# EAGLE board Robo_opcao (EAGLE 9.5.1)
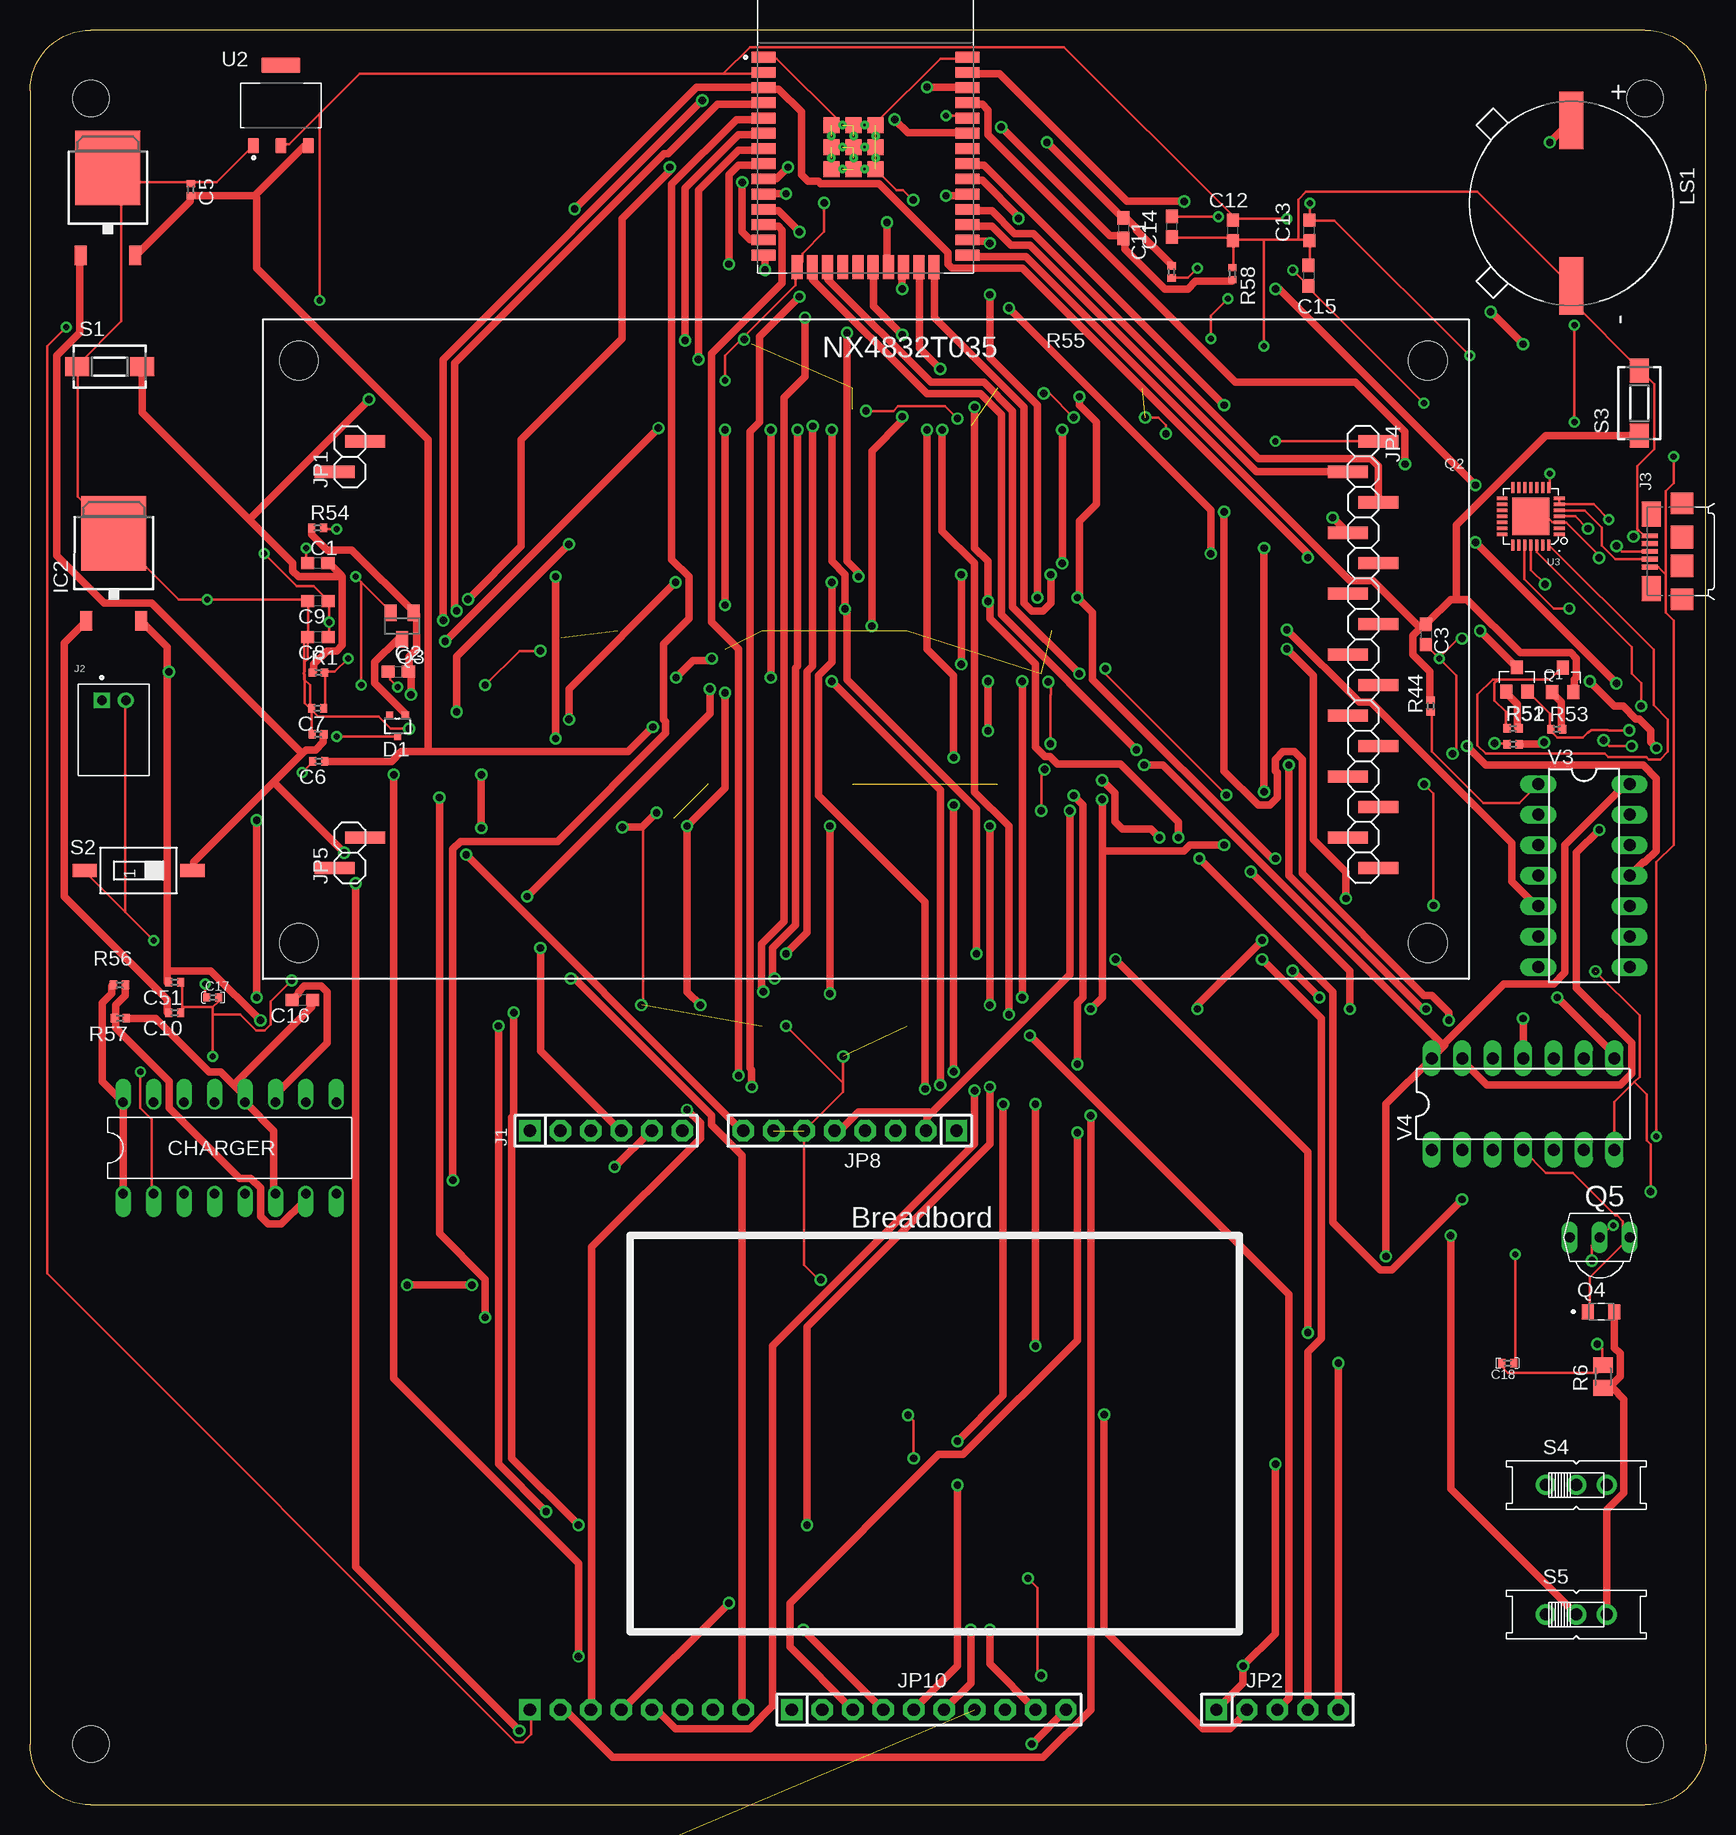
[diagram p2: board, top side]
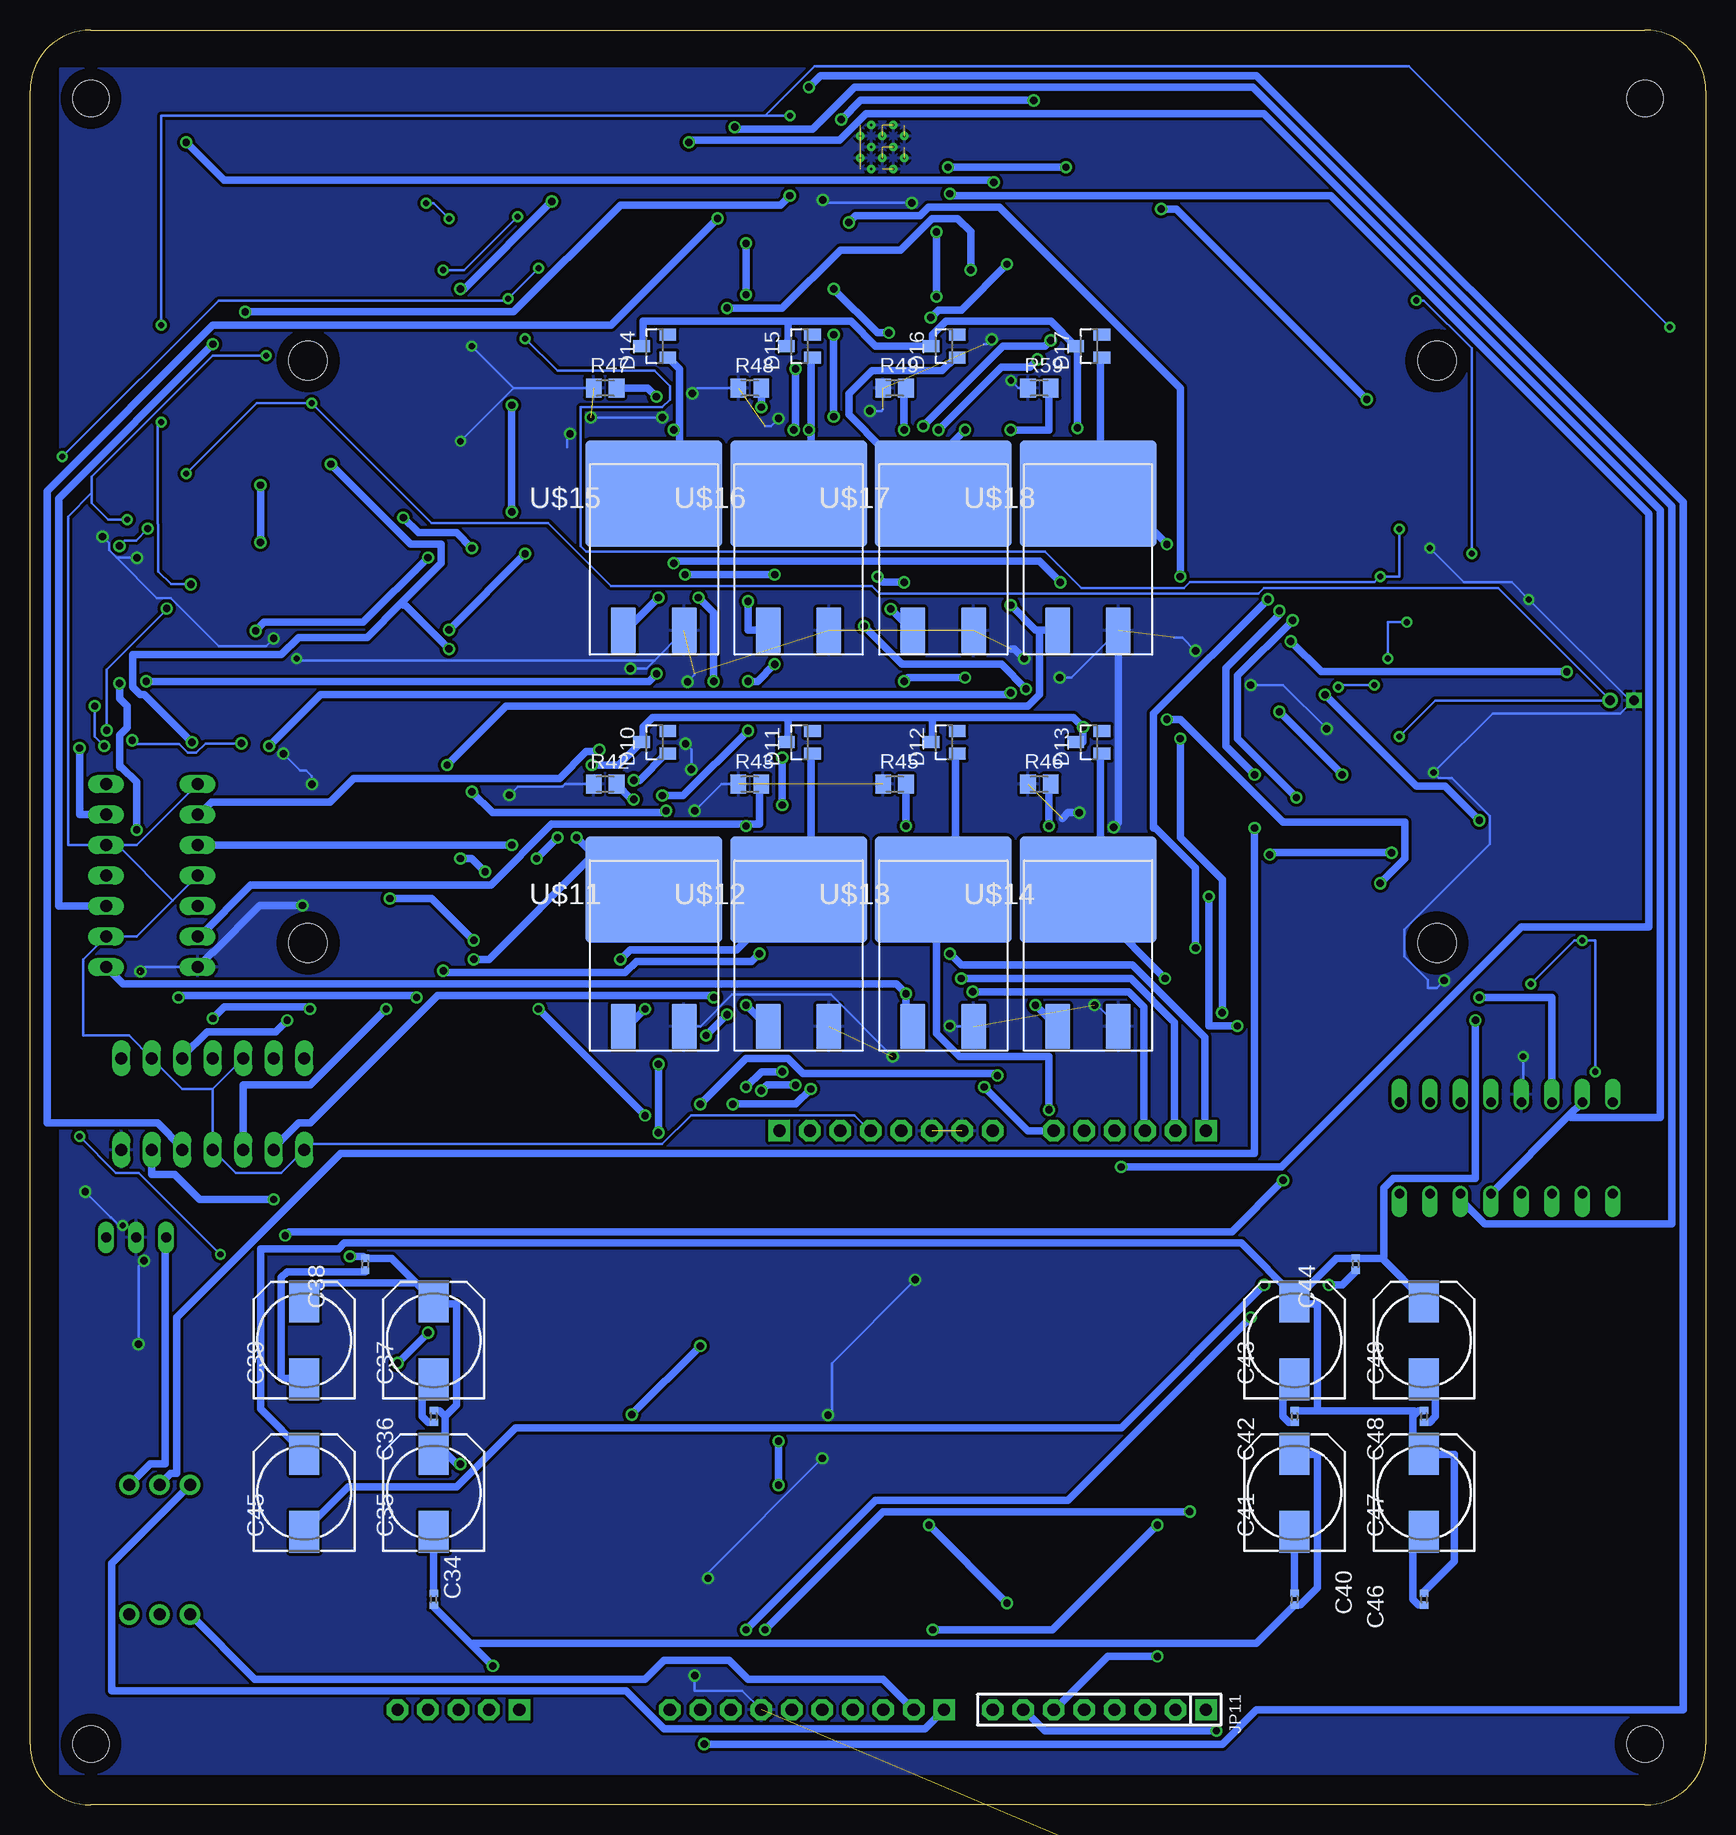
[diagram p3: board, bottom side, seen from below]

Size 139.7 x 147.96 mm. Coordinates in mm from the lower left corner, seen from the top.
Outline: 0,142.88 0,5.08 arc90 5.08,0 134.62,0 arc90 139.7,5.08 139.7,142.88 arc90 134.62,147.96 5.08,147.96 arc90 0,142.88
Copper layers (1*16): Top 0.035mm / dielectric 1.5mm / Bottom 0.035mm
Design rules "default *": minimum track width 8mil, minimum drill 6mil, track to track 6mil, track to pad 6mil, pad to pad 6mil, via to via 6mil, smd to smd 6mil, copper to edge 40mil, drill to drill 6mil, minimum pad ring 10mil, minimum via ring 8mil, stop-mask expansion 4mil, vias tented up to drill 0mil, thermal gap 10mil
Net classes: 0 default: width 0.61 mm, drill 0.61 mm, clearance 0.254 mm; 1 x: width 0.203 mm, drill 0.508 mm, clearance 0.254 mm
Holes 3 mm at 5.08,142.24 5.08,5.08 134.62,142.24 134.62,5.08

## Footprints (pad centres in the part's own frame; a part is rotated, then mirrored left to right if it is on the bottom)
C0603 = smd 1.1 x 1: 1 -0.85,0; 2 0.85,0
0402 = smd 0.6 x 0.7: 1 -0.5,0; 2 0.5,0
0402_POL = smd 0.6 x 0.7: P+ -0.5,0; P- 0.5,0
150CLZ-0810 = smd 3.5 x 2.5: + 3.25,0; - -3.25,0
DIP14 = drill 0.8 offset: P$1 -3.81,8.89; P$2 -3.81,6.35; P$3 -3.81,3.81; P$4 -3.81,1.27; P$5 -3.81,-1.27; P$6 -3.81,-3.81; P$7 -3.81,-6.35; P$8 -3.81,-8.89; P$9 3.81,-8.89; P$10 3.81,-6.35; P$11 3.81,-3.81; P$12 3.81,-1.27; P$13 3.81,1.27; P$14 3.81,3.81; P$15 3.81,6.35; P$16 3.81,8.89
SOT323 = smd 0.6 x 0.55: 1 -0.65,-0.925; 2 0.65,-0.925; 3 0,0.925
SOT23 = smd 1 x 1.4: 1 -0.95,-1.1; 2 0.95,-1.1; 3 0,1.1
TO252 = smd 1 x 1.6: 1 -2.28,-4.8; 2 2.28,-4.8 | smd 5.4 x 6.2: 3 0,2.5
SIP-100-06-40 = drill 1.016 pad 1.778 square: 1 -6.35,0 | drill 1.016 pad 1.778 octagon: 2 -3.81,0; 3 -1.27,0; 4 1.27,0; 5 3.81,0; 6 6.35,0
JST_S2B-PH-K-S(LF)(SN) = drill 0.8 square: 1 -1,0 | drill 0.8: 2 1,0
ZX62-B-5PA(11) = smd 0.4 x 1.35: 1 -1.3,2.675; 2 -0.65,2.675; 3 0,2.675; 4 0.65,2.675; 5 1.3,2.675 | smd 2.1 x 1.6: SH1 -3.1,2.55; SH2 3.1,2.55 | smd 1.8 x 1.9: SH3 -4,0; SH6 4,0 | smd 1.9 x 1.9: SH4 -1.2,0; SH5 1.2,0
1X02SMD = smd 1.016 x 3.302: 1 -1.27,1.27; 2 1.27,-1.27
SIP-100-05-40 = drill 1.016 pad 1.778 square: 1 -5.08,0 | drill 1.016 pad 1.778 octagon: 2 -2.54,0; 3 0,0; 4 2.54,0; 5 5.08,0
SIP-100-08-40 = drill 1.016 pad 1.778 square: 1 -8.89,0 | drill 1.016 pad 1.778 octagon: 2 -6.35,0; 3 -3.81,0; 4 -1.27,0; 5 1.27,0; 6 3.81,0; 7 6.35,0; 8 8.89,0
1X15SMD = smd 1.016 x 3.302: 1 -1.27,1.27; 2 1.27,-1.27; 3 3.81,1.27; 4 6.35,-1.27; 5 8.89,1.27; 6 11.43,-1.27; 7 13.97,1.27; 8 16.51,-1.27; 9 19.05,1.27; 10 21.59,-1.27; 11 24.13,1.27; 12 26.67,-1.27; 13 29.21,1.27; 14 31.75,-1.27; 15 34.29,1.27
SIP-100-10-40 = drill 1.016 pad 1.778 square: 1 -11.43,0 | drill 1.016 pad 1.778 octagon: 2 -8.89,0; 3 -6.35,0; 4 -3.81,0; 5 -1.27,0; 6 1.27,0; 7 3.81,0; 8 6.35,0; 9 8.89,0; 10 11.43,0
XDCR_CPT-1762_ROBO = smd 4.8 x 2: N 6.9,0; P -6.9,0
SOT-23 = smd 1.016 x 1.143: 1 -0.889,-1.016; 2 0.889,-1.016; 3 0,1.016
TRANS_SFH_3716 = smd 1 x 1.25: 1 -1.1,0; 2 1.1,0
TSOP18XX = drill 0.813 long: GND -0.001,-0.027; OUT -2.501,-0.027; VCC 2.499,-0.027
M0805 = smd 1.3 x 1.6: 1 -0.95,0; 2 0.95,0
DTSM-3 = smd 2 x 1.6: 1 -2.7,0; 2 2.7,0
SMS-001 = smd 1.092 x 2.007: 1 0,-4.496; 2 0,4.496
EG1218_ROBO = drill 1 pad 1.676: O -2.54,0; P 0,0; S 2.54,0
MODULE_ESP32-WROOM-32D = smd 2 x 0.9: 1 -8.5,5.26; 2 -8.5,3.99; 3 -8.5,2.72; 4 -8.5,1.45; 5 -8.5,0.18; 6 -8.5,-1.09; 7 -8.5,-2.36; 8 -8.5,-3.63; 9 -8.5,-4.9; 10 -8.5,-6.17; 11 -8.5,-7.44; 12 -8.5,-8.71; 13 -8.5,-9.98; 14 -8.5,-11.25; 25 8.5,-11.25; 26 8.5,-9.98; 27 8.5,-8.71; 28 8.5,-7.44; 29 8.5,-6.17; 30 8.5,-4.9; 31 8.5,-3.63; 32 8.5,-2.36; 33 8.5,-1.09; 34 8.5,0.18; 35 8.5,1.45; 36 8.5,2.72; 37 8.5,3.99; 38 8.5,5.26 | smd 0.9 x 2: 15 -5.715,-12.25; 16 -4.445,-12.25; 17 -3.175,-12.25; 18 -1.905,-12.25; 19 -0.635,-12.25; 20 0.635,-12.25; 21 1.905,-12.25; 22 3.175,-12.25; 23 4.445,-12.25; 24 5.715,-12.25 | smd 1.33 x 1.33: 39_1 -2.835,-0.405; 39_2 -1,-0.405; 39_3 0.835,-0.405; 39_4 -2.835,-2.24; 39_5 -1,-2.24; 39_6 0.835,-2.24; 39_7 -2.835,-4.075; 39_8 -1,-4.075; 39_9 0.835,-4.075 | drill 0.2 pad 0.3: 39_10 -1.917,-0.405; 39_11 -0.083,-0.405; 39_12 -2.835,-1.323; 39_13 -1,-1.323; 39_14 0.835,-1.323; 39_15 -1.917,-2.24; 39_16 -0.083,-2.24; 39_17 -2.835,-3.158; 39_18 -1,-3.158; 39_19 0.835,-3.158; 39_20 -1.917,-4.075; 39_21 -0.083,-4.075
SOT229P700X180-4N = smd 0.93 x 1.31: 1 -2.29,-3.345; 2 0,-3.345; 3 2.29,-3.345 | smd 3.24 x 1.31: 4 0,3.345
QFN28G_0.5-5X5MM_ROBO = smd 0.9 x 0.254: 1 -2.384,1.5; 2 -2.384,1; 3 -2.384,0.5; 4 -2.384,0; 5 -2.384,-0.5; 6 -2.384,-1; 7 -2.384,-1.5; 15 2.384,-1.5; 16 2.384,-1; 17 2.384,-0.5; 18 2.384,0; 19 2.384,0.5; 20 2.384,1; 21 2.384,1.5 | smd 0.254 x 0.9: 8 -1.5,-2.384; 9 -1,-2.384; 10 -0.5,-2.384; 11 0,-2.384; 12 0.5,-2.384; 13 1,-2.384; 14 1.5,-2.384; 22 1.5,2.384; 23 1,2.384; 24 0.5,2.384; 25 0,2.384; 26 -0.5,2.384; 27 -1,2.384; 28 -1.5,2.384 | smd 3.1 x 3.1: 29 0,0
NEXTION = hole 3.2: 4,50.54; 4,2; 98.1,2; 98.1,50.54
SMD = smd 2.08 x 3.81: 1 2.79,-13.85; 3 7.86,-13.85 | smd 11.43 x 8.89: 2 5.33,-2.45
DIL14_FT = drill 1 long: 1 -7.62,-3.81; 2 -5.08,-3.81; 3 -2.54,-3.81; 4 0,-3.81; 5 2.54,-3.81; 6 5.08,-3.81; 7 7.62,-3.81; 8 7.62,3.81; 9 5.08,3.81; 10 2.54,3.81; 11 0,3.81; 12 -2.54,3.81; 13 -5.08,3.81; 14 -7.62,3.81

## Placement (x,y rotation side)
C1  0,1 uF  [C0603]  23.99,103.52 0 top
C2  0,01 uF  [C0603]  30.7,94.46 0 top
C3  0,1 uF  [C0603]  116.36,97.57 270 top
C4  0.33uF  [0402]  24.02,89.24 0 top
C5  0.1uF  [0402]  13.4,134.65 270 top
C6  0.1uF  [0402]  24.07,86.99 180 top
C7  22uF  [0402]  23.97,91.41 180 top
C8  0,1 uF  [C0603]  24,97.34 180 top
C9  10 uF  [C0603]  24.01,100.36 180 top
C10  0.33uF  [0402]  12.06,66.04 180 top
C11  1 uF  [C0603]  91.13,131.44 270 top
C12  10 uF  [C0603]  100.29,131.24 90 top
C13  0,1 uF  [C0603]  106.64,131.24 90 top
C14  0,1 uF  [C0603]  95.21,131.56 90 top
C15  10 uF  [C0603]  106.58,127.48 270 top
C16  0.01 uF  [C0603]  22.7,67.09 180 top
C17  10uF  [0402_POL]  15.24,67.31 0 top
C18  20uF  [0402_POL]  123.19,36.83 180 top
C34  100n  [0402]  106.05,17.14 270 bottom
C35  470u  [150CLZ-0810]  106.05,26.04 90 bottom
C36  100n  [0402]  106.05,32.38 90 bottom
C37  470u  [150CLZ-0810]  106.05,38.73 90 bottom
C38  100n  [0402]  111.76,45.09 90 bottom
C39  470u  [150CLZ-0810]  116.84,38.73 90 bottom
C40  100n  [0402]  34.29,17.14 270 bottom
C41  470u  [150CLZ-0810]  34.29,26.04 90 bottom
C42  100n  [0402]  34.29,32.38 90 bottom
C43  470u  [150CLZ-0810]  34.29,38.73 90 bottom
C44  100n  [0402]  29.21,45.09 90 bottom
C45  470u  [150CLZ-0810]  116.84,26.04 90 bottom
C46  100n  [0402]  23.5,17.14 90 bottom
C47  470u  [150CLZ-0810]  23.5,26.04 90 bottom
C48  100n  [0402]  23.5,32.38 90 bottom
C49  470u  [150CLZ-0810]  23.5,38.73 90 bottom
C51  0.1uF  [0402]  12.06,68.58 180 top
CHARGER  MAX712  [DIP14]  16.65,54.78 90 top
D1  HSMS-285B  [SOT323]  30.64,89.95 180 top
D10  BAS40  [SOT23]  87.63,88.58 90 bottom
D11  BAS40  [SOT23]  75.56,88.58 90 bottom
D12  BAS40  [SOT23]  63.5,88.58 90 bottom
D13  BAS40  [SOT23]  51.44,88.58 90 bottom
D14  BAS40  [SOT23]  87.63,121.6 90 bottom
D15  BAS40  [SOT23]  75.56,121.6 90 bottom
D16  BAS40  [SOT23]  63.5,121.6 90 bottom
D17  BAS40  [SOT23]  51.44,121.6 90 bottom
IC1  7805DT  [TO252]  6.49,133.97 0 top
IC2  7805DT  [TO252]  6.99,103.5 0 top
J1  F-1X06-SIP-100-40  [SIP-100-06-40]  48.02,56.2 0 top
J2  S2B-PH-K-S(LF)(SN)  [JST_S2B-PH-K-S(LF)(SN)]  6.99,92.08 0 top
J3  ZX62-B-5PA  [ZX62-B-5PA(11)]  137.71,104.49 90 top
J4  F-1X06-SIP-100-40  [SIP-100-06-40]  9.84,-5.4 0 top  (outside the outline)
JP1  [1X02SMD]  26.67,112.39 90 top
JP2  F-1X05-SIP-100-40  [SIP-100-05-40]  103.98,7.94 0 top
JP3  F-1X08-SIP-100-40  [SIP-100-08-40]  12.38,-11.43 0 top  (outside the outline)
JP4  [1X15SMD]  111.12,112.39 270 top
JP5  [1X02SMD]  26.67,79.38 90 top
JP6  F-1X10-SIP-100-40  [SIP-100-10-40]  14.92,-17.46 0 top  (outside the outline)
JP7  F-1X05-SIP-100-40  [SIP-100-05-40]  8.57,-23.5 0 top  (outside the outline)
JP8  F-1X08-SIP-100-40  [SIP-100-08-40]  68.34,56.2 180 top
JP10  F-1X10-SIP-100-40  [SIP-100-10-40]  74.93,7.94 0 top
JP11  F-1X08-SIP-100-40  [SIP-100-08-40]  50.56,7.94 180 bottom
LS1  CPT-1762-90-SMT-TRXDCR_CPT-1762_ROBO  [XDCR_CPT-1762_ROBO]  128.48,133.52 270 top
Q1  SMD-TRANSISTORS-NPN-25V-500MW(SOT-23)  [SOT-23]  123.95,93.82 0 top
Q2  SMD-TRANSISTORS-NPN-25V-500MW(SOT-23)  [SOT-23]  127.76,93.79 0 top
Q3  [SOT23]  31.02,98.27 180 top
Q4  SFH_3716  [TRANS_SFH_3716]  130.97,41.12 0 top
Q5  TSOP4838  [TSOP18XX]  130.85,47.33 0 top
R1  10k  [0402]  24.04,94.39 0 top
R6  1k  [M0805]  131.13,35.72 90 top
R42  10k  [M0805]  91.76,85.09 0 bottom
R43  10k  [M0805]  79.69,85.09 0 bottom
R44  10k  [0402]  116.74,91.6 90 top
R45  10k  [M0805]  67.63,85.09 0 bottom
R46  10k  [M0805]  55.56,85.09 0 bottom
R47  10k  [M0805]  91.76,118.11 0 bottom
R48  10k  [M0805]  79.69,118.11 0 bottom
R49  10k  [M0805]  67.63,118.11 0 bottom
R51  470R  [0402]  123.62,88.42 0 top
R52  10k  [0402]  123.62,89.74 0 top
R53  10k  [0402]  127.27,89.68 0 top
R54  150R  [0402]  23.97,106.46 0 top
R55  680R  [0402]  95.15,127.79 270 top
R56  68k  [0402]  7.46,68.36 0 top
R57  22k  [0402]  7.52,65.56 180 top
R58  1R  [0402]  100.23,127.64 270 top
R59  10k  [M0805]  55.56,118.11 0 bottom
S1  EN  [DTSM-3]  6.64,119.89 0 top
S2  SWS001  [SMS-001]  9.05,77.89 270 top
S3  BOOT  [DTSM-3]  134.16,116.85 90 top
S4  EG1218  [EG1218_ROBO]  128.91,26.67 0 top
S5  EG1218  [EG1218_ROBO]  128.91,15.88 0 top
U1  ESP32-WROOM-32D  [MODULE_ESP32-WROOM-32D]  69.65,140.43 0 top
U2  AMS1117-3.3  [SOT229P700X180-4N]  20.93,141.67 0 top
U3  INTERFACE-CP2102-GMR(QFN28)QFN28G_ROBO  [QFN28G_0.5-5X5MM_ROBO]  125.09,107.41 180 top
U$1  [NEXTION]  18.42,69.85 0 top
U$11  IRFZ44NSMD  [SMD]  93.03,78.74 0 bottom
U$12  IRFZ44NSMD  [SMD]  80.96,78.74 0 bottom
U$13  IRFZ44NSMD  [SMD]  68.9,78.74 0 bottom
U$14  IRFZ44NSMD  [SMD]  56.83,78.74 0 bottom
U$15  IRFZ44NSMD  [SMD]  93.03,111.76 0 bottom
U$16  IRFZ44NSMD  [SMD]  80.96,111.76 0 bottom
U$17  IRFZ44NSMD  [SMD]  68.9,111.76 0 bottom
U$18  IRFZ44NSMD  [SMD]  56.83,111.76 0 bottom
V3  7408  [DIL14_FT]  129.54,77.47 270 top
V4  7408  [DIL14_FT]  124.46,58.42 0 top

## Tracks (layer width: path | path; a pad name or v marks a point on that pad's centre or on a via)
1_S  (via drill 0.61)
  Top 0.61: v54.61,122.08 54.61,134.78 59.05,139.22 61.12,139.22 U1.6 | v65.25,114.94 65.25,94.93 64.77,94.46 64.77,72.71 v63.02,70.96
  Bottom 0.61: v54.61,122.08 55.09,121.6 58.58,121.6 v65.25,114.94 | v63.02,70.96 62.07,70.01 47.78,70.01 41.75,63.98 41.75,56.2 J1.1
2_S  (via drill 0.61)
  Top 0.61: v55.72,120.49 55.72,134.62 59.05,137.95 61.12,137.95 U1.7 | v63.98,114.62 63.98,94.93 63.82,94.77 63.82,73.34 61.91,71.44 61.91,69.06 v62.07,68.9
  Bottom 0.61: v55.72,120.49 56.36,119.86 58.74,119.86 v63.98,114.62 | v62.07,68.9 47.94,68.9 44.29,65.25 44.29,56.2 J1.2
3_S  (via drill 0.61)
  Top 0.61: v58.26,128.43 58.26,135.89 59.05,136.68 61.12,136.68 U1.8 | v64.61,123.98 64.61,119.06 62.87,117.32 62.87,95.25 62.87,73.66 60.96,71.75 60.96,67.94 v61.12,67.79
  Bottom 0.61: v58.26,128.43 62.07,124.62 63.98,124.62 v64.61,123.98 | v61.12,67.79 48.1,67.79 46.83,66.52 46.83,56.2 J1.3
4_S  (via drill 0.61)
  Top 0.61: v63.18,136.53 62.23,135.57 61.28,135.57 U1.9 | v53.34,136.53 53.34,136.21 49.37,132.24 49.37,122.24 40.96,113.82 40.96,104.93 v36.51,100.49 | v42.55,71.44 42.55,62.87 49.21,56.2 J1.4
  Bottom 0.61: v53.34,136.53 v63.18,136.53 | v36.51,100.49 46.04,90.96 46.04,81.44 45.88,81.44 42.55,78.11 v42.55,71.44
5_S  (via drill 0.61)
  Top 0.61: v63.02,134.3 61.28,134.3 U1.10 | v48.74,53.18 51.75,56.2 J1.5
  Bottom 0.61: v63.02,134.3 62.87,134.14 31.27,134.14 4.76,107.63 4.76,73.18 15.4,73.18 35.4,53.18 v48.74,53.18
5V  (via drill 0.61)
  Top 0.61: v108.58,107.31 JP4.4 | v102.87,84.45 v102.87,104.78 | v86.68,82.87 86.68,69.22 75.09,57.63 | 75.09,57.63 74.77,57.31 74.77,56.2 JP8.2 | JP8.5 67.47,56.2 69.06,57.78 74.93,57.78 75.09,57.63
  Bottom 0.61: v108.58,107.31 107.31,106.05 104.14,106.05 v102.87,104.78 | v102.87,84.45 101.12,82.71 86.84,82.71 v86.68,82.87
6_S  (via drill 0.61)
  Top 0.61: v64.14,131.13 62.39,132.87 61.28,132.87 U1.11 | v64.14,125.73 60.8,122.4 60.8,115.25 60.01,114.46 60.01,61.44 60.17,61.28 v60.17,59.85
  Bottom 0.61: v64.14,125.73 v64.14,131.13 | v60.17,59.85 56.52,56.2 J1.6
7_S  (via drill 0.61)
  Top 0.61: v59.05,60.8 59.05,96.36 56.83,98.58 56.83,120.97 62.71,126.84 62.71,131.29 62.39,131.6 61.28,131.6 U1.12 | v83.82,38.26 v83.82,58.42 | v89.53,32.54 89.53,14.61 97.79,6.35 100.01,6.35 101.44,7.78 JP2.2
  Bottom 0.61: v59.05,60.8 59.21,60.96 75.25,60.96 76.52,62.23 80.01,62.23 v83.82,58.42 | v89.53,32.54 v83.82,38.26
8_S  (via drill 0.61)
  Top 0.61: v75.88,119.7 74.14,121.44 74.14,128.11 U1.23 | v76.04,114.62 76.04,106.2 78.74,103.5 78.74,84.45 81.6,81.6 v81.6,65.88 | v83.34,64.14 104.93,42.55 104.93,8.89 JP2.3
  Bottom 0.61: v75.88,119.7 75.88,114.62 v76.04,114.62 | v83.34,64.14 v81.6,65.88
9(5V)  (via drill 0.61)
  Top 0.61: v92.23,87.95 80.96,99.22 80.96,115.89 79.22,117.63 74.77,117.63 65.25,127.16 65.25,128.11 U1.16
  Bottom 0.61: v92.23,87.95 92.39,87.79 93.34,87.79 95.57,85.57 112.71,85.57 114.7,83.58 124.54,83.58 125.57,82.55 V3.2
10(5V)  (via drill 0.61)
  Top 0.61: v61.28,127.95 61.28,129.06 U1.14 | v81.6,124.78 98.42,107.95 v98.42,104.3 | v104.78,97.95 110.81,91.92 111.76,91.92 123.51,80.17 123.51,76.99 125.57,74.93 V3.5
  Bottom 0.61: v81.6,124.78 76.99,124.78 72.15,129.62 67.15,129.62 64.53,132.24 62.39,132.24 61.28,131.13 v61.28,127.95 | v104.78,97.95 v98.42,104.3
11(5V)  (via drill 0.61)
  Top 0.61: v76.36,134.14 78.11,134.14 U1.29 | v124.46,121.76 v121.76,124.46
  Bottom 0.61: v76.36,134.14 77.15,133.35 90.49,133.35 99.38,124.46 v121.76,124.46 | v124.46,121.76 137.32,108.9 137.32,74.93 V3.10
12(5V)  (via drill 0.61)
  Top 0.61: v87.47,94.3 81.92,99.85 81.92,116.2 79.53,118.59 75.09,118.59 66.52,127.16 66.52,128.11 U1.17 | v135.57,88.11 135.1,88.58 135.1,89.58 134.14,90.53 133.86,90.53 132.79,91.6 132.08,91.6 v130.02,93.66
  Bottom 0.61: v87.47,94.3 88.11,93.66 v130.02,93.66 | v135.57,88.11 135.57,82.55 V3.13
13(5V)  (via drill 0.61)
  Top 0.61: v80.01,130.18 79.85,130.33 78.26,130.33 U1.26 | v80.01,125.89 80.01,120.65 83.98,116.68 v83.98,100.65 | v82.71,67.31 v82.71,93.66
  Bottom 0.61: v80.01,125.89 v80.01,130.18 | v83.98,100.65 82.71,99.38 v82.71,93.66 | v82.71,67.31 82.87,67.47 105.73,67.47 116.36,56.83 117.32,56.83 119.38,54.77 V4.2
B+  (via drill 0.51)
  Top 0.203: v126.68,110.97 126.68,109.86 U3.8 | v116.2,116.84 106.52,126.52 C15.2 106.52,126.68 v105.25,127.95 | v99.06,132.4 95.25,132.4 C14.2 | v25.56,89.06 30.64,89.06 D1.3 | v14.61,68.42 14.61,67.31 C17.P+ | 7.94,74.45 4.6,77.79 S2.1 | 7.94,74.45 v10.32,72.07 | v9.21,61.12 9.21,58.1 10.16,57.15 10.16,51.12 CHARGER.P$2 | 7.94,74.45 7.94,92.08 J2.2
  Bottom 0.203: v126.68,110.97 120.81,116.84 v116.2,116.84 106.2,106.84 96.52,106.84 91.28,101.6 69.53,101.6 68.9,100.97 37.31,100.97 36.83,101.44 17.3,101.44 7.94,92.08 J2.2 22.54,92.08 v25.56,89.06 | v99.06,132.4 103.5,127.95 v105.25,127.95 | v14.61,68.42 10.95,72.07 v10.32,72.07 9.21,72.07 v9.21,61.12
B-  (via drill 0.61)
  Top 0.61: R58.2 100.17,127 97.16,127 96.52,126.36 94.61,126.36 91.28,129.7 91.28,130.49 C11.2 90.96,130.81 90.01,130.81 v80.96,139.86 | R57.1 10.48,65.56 14.92,61.12 15.88,61.12 16.99,60.01 | 16.99,60.01 17.78,59.21 17.78,58.74 CHARGER.P$12 18.1,58.42 20.32,56.2 20.32,51.12 CHARGER.P$6 | 16.99,60.01 23.5,66.52 23.5,66.99 C16.1
  Bottom 0.61: v80.96,139.86 80.8,139.7 74.45,139.7 70.96,143.19 37.78,143.19 2.86,108.27 2.86,48.42 18.41,48.42 20.32,50.32 20.32,50.96 CHARGER.P$6
BUZZER  (via drill 0.61)
  Top 0.61: v59.37,135.25 59.37,131.13 60.01,130.49 61.12,130.49 U1.13 | v126.68,138.59 128.43,140.34 LS1.P
  Bottom 0.61: v59.37,135.25 59.53,135.41 123.51,135.41 v126.68,138.59
DC_IN  (via drill 0.51)
  Top 0.203: v25.56,106.36 24.61,106.36 R54.2 | 27.62,101.92 30.16,99.38 Q3.2 | 27.62,101.92 v27.15,102.39 | v30.64,93.19 30,93.82 30,94.46 C2.1 | 27.62,101.92 v27.62,93.34 | v123.83,45.88 123.83,36.83 C18.P+ | v135.57,55.72 135.57,78.58 137,80.01 137,98.74 136.37,99.38 136.37,102.55 | 136.37,102.55 135.73,103.19 135.1,103.19 J3.1 | v97.31,128.11 96.52,127.32 95.25,127.32 R55.2 | v137,112.39 137,110.17 136.37,109.54 136.37,102.55 | v98.42,122.24 98.42,124.14 v99.85,125.57
  Bottom 0.203: v25.56,106.36 25.56,102.39 v27.15,102.39 27.62,101.92 43.02,101.92 43.5,101.44 52.07,101.44 55.09,104.46 93.34,104.46 93.82,104.93 93.82,116.52 87,116.52 86.36,117.16 86.36,118.27 87.63,119.54 95.73,119.54 v98.42,122.24 | v30.64,93.19 30.48,93.34 v27.62,93.34 | v123.83,45.88 130.65,52.7 132.56,52.7 v135.57,55.72 | v97.31,128.11 v99.85,125.57 100.01,125.41 123.98,125.41 v137,112.39
DTR
  Top 0.203: 122.4,93.82 122.08,93.5 122.08,92.08 123.03,91.12 123.03,89.85 R52.1 | 122.4,93.82 126.68,93.82 127.64,94.77 Q2.3 | U3.28 135.33,96.29 135.33,91.68 136.53,90.49 136.53,87.79 135.89,87.15 134.94,87.15 134.78,87.31 134.76,87.31 134.74,87.34 131.58,87.34 131.29,87.63 121.34,87.63 120.65,88.32 120.65,92.55 121.92,93.82 122.4,93.82
EN  (via drill 0.61)
  Top 0.61: 25.88,102.55 24.92,103.5 C1.2 | 25.88,102.55 26.04,102.39 26.04,96.68 25.56,96.2 24.77,96.2 23.65,95.09 23.65,94.46 R1.1 | 18.26,107.16 21.91,103.5 21.91,102.87 22.38,102.39 25.72,102.39 25.88,102.55 | 18.26,107.16 9.37,116.05 9.37,119.86 S1.2 | v120.89,97.87 123.83,94.93 Q1.3 | v106.52,103.98 106.52,104.3 82.71,128.11 76.83,128.11 76.52,128.43 76.52,129.38 70.77,135.13 65.92,135.13 65.71,135.33 64.85,135.33 64.29,135.89 64.29,141.13 62.39,143.03 61.28,143.03 U1.3 60.96,143.19 55.56,143.19 v45.4,133.03 | v28.26,117.16 18.26,107.16
  Bottom 0.61: v120.89,97.87 120.17,98.58 111.92,98.58 v106.52,103.98 | v28.26,117.16 44.13,133.03 v45.4,133.03
GND  (via drill 0.51, 0.61)  (27 unrouted)
  Top 0.203: U2.1 18.57,138.27 15.56,135.25 13.49,135.25 C5.1 13.34,135.25 7.62,135.25 | 7.62,135.25 6.51,136.37 IC1.3 7.62,135.25 | C4.1 23.5,89.38 23.5,91.28 C7.2 23.34,91.44 23.34,93.34 22.86,93.82 22.86,97.16 23.02,97.31 C8.2 | C8.2 23.18,97.47 23.18,100.33 C9.2 23.02,100.49 v14.76,100.49 12.38,100.49 6.99,105.89 IC2.3 6.99,106.05 3.97,109.06 3.97,119.86 S1.1 3.97,120.02 7.62,123.67 7.62,135.25 | C15.1 106.68,128.43 106.68,130.33 C13.1 106.52,130.49 105.73,130.49 | R58.1 100.33,128.27 100.33,130.33 C12.1 | C14.1 95.25,130.65 100.01,130.65 100.17,130.49 C12.1 | 102.87,130.49 100.33,130.49 C12.1 | 102.87,130.49 105.73,130.49 | J3.5 134.94,105.89 134.46,105.89 134.06,106.28 | 105.73,130.49 105.73,133.83 106.36,134.46 120.65,134.46 128.43,126.68 LS1.N 128.59,126.52 128.59,125.25 134.14,119.7 S3.2 134.3,119.54 135.41,118.43 135.41,113.03 133.99,111.6 133.99,106.36 134.06,106.28 | 131.05,36.43 131.13,36.51 R6.2 | 131.05,36.43 130.65,36.04 123.19,36.04 122.71,36.51 122.71,36.83 C18.P- | 12.7,66.52 12.7,68.58 C51.1 | 12.7,66.52 12.7,66.04 C10.1 | 15.24,66.52 15.72,66.99 15.72,67.31 C17.P- | 12.7,66.52 15.24,66.52 | v22.7,86.04 23.5,86.84 C6.2 | v23.02,104.78 23.02,103.66 C1.1 | v117.47,95.57 116.36,96.68 C3.2 | U1.39_7 66.83,136.37 66.83,137.16 U1.39_17 | U1.39_8 68.74,136.37 68.74,137.16 U1.39_18 | U1.39_4 66.83,138.27 66.83,139.06 U1.39_12 | U1.39_21 69.69,136.37 70.33,136.37 U1.39_9 72.22,134.62 72.79,134.62 v73.62,133.79 | U1.39_1 66.83,140.02 67.63,140.02 U1.39_10 67.63,140.18 62.23,145.57 61.28,145.57 U1.1 | U1.39_5 68.74,138.27 68.74,139.06 U1.39_13 | U1.39_6 70.33,138.27 69.69,138.27 U1.39_16
  Top 0.203: U1.39_2 68.74,140.02 69.53,140.02 U1.39_11 69.69,140.02 70.33,140.02 U1.39_3 70.48,140.18 75.88,145.57 78.11,145.57 U1.38 | 59.45,122.32 57.94,120.81 v57.94,118.75 | 59.45,122.32 63.82,126.68 63.82,128.11 U1.15 64.4,128.65 64.4,129.33 66.2,131.13 v66.2,133.54 | v15.24,62.39 15.24,65.88 | 15.24,65.88 15.24,66.52 | v103.82,113.67 JP4.1 | v102.87,121.6 102.87,130.49 | U3.29 126.4,107.41 126.88,106.93 127.46,106.93 U3.3 127.5,106.9 128.08,106.9 130.79,104.18 v130.79,103.96 | v65.92,43.78 65.76,43.78 64.53,45.01 JP8.6 67.79,59.45 67.79,60.17 | v73.18,32.5 73.66,32.02 v73.66,28.89 | v84.3,10.79 83.98,11.11 83.98,18.1 v83.19,18.89 | v92.96,115.66 94.05,115.66 94.69,115.02 v94.69,114.3 | v84.5,117.67 84.98,117.67 v86.99,115.66 | v117.47,95.57 118.9,94.14 118.9,87.95 v118.59,87.63 | v116.2,85.09 117,84.3 v117,74.97 | v99.73,84.18 89.65,94.26 v89.65,94.73 | v84.3,82.87 84.3,86.04 v84.57,86.32 | v85.06,88.45 85.06,92.52 85.09,92.55 85.09,93.42 v84.89,93.62 | v67.79,62.39 67.79,60.17 | v63.02,64.93 67.79,60.17 | V4.7 132.08,58.6 133.74,60.26 | 133.74,60.26 134.17,60.69 134.17,65.81 v130.49,69.49 | v21.82,68.73 20.07,66.98 20.07,65.05 19.57,64.54 18.85,64.54 17.51,65.88 15.24,65.88 | v69.69,116.2 71.96,116.2 72.35,116.59 76.29,116.59 v77.31,115.57 | 59.45,122.32 59.45,122.24 v59.53,122.16 | C8.2 23.15,95.52 22.88,95.25 22.88,94.5 22.83,94.31 22.88,94.22 22.88,91.84 24.02,90.71 29.08,90.71 30.08,89.71 v31.61,89.71 | v37.94,93.34 40.8,96.2 v42.55,96.2 | 51.12,81.6 51.12,66.83 v50.96,66.67 | 133.74,60.26 134.76,59.23 134.76,55.38 135.1,55.05 v135.1,51.12 | 134.06,106.28 133.67,105.88 v133.67,105.73
  Top 0.203: v117.47,95.57 117.47,95.65 119.14,97.31 119.3,97.31 v119.38,97.23 | v131.98,48.32 131.87,48.32 Q5.GND 130.2,46.66 v130.2,45.38 | v130.65,38.42 131.05,38.02 131.05,36.43
  Top 0.61: v49.37,81.5 51.02,81.5 51.12,81.6 v52.23,82.71 | v53.86,93.98 55.29,95.41 56.67,95.41 v56.83,95.57
  Bottom 0.203: 6.19,91.92 6.03,92.08 J2.1 6.19,91.92 | 6.19,91.92 7.14,90.96 17.78,90.96 v22.7,86.04 22.25,85.59 21.19,85.59 18.03,82.43 18.03,80.09 25.14,72.98 25.14,70.72 23.18,68.76 23.18,68.1 22.44,68.1 v21.82,68.73 | v23.02,104.78 20.16,101.92 16.19,101.92 v14.76,100.49 6.19,91.92 | v117.47,95.57 117.32,95.41 87.63,95.41 | 87.63,95.41 85.25,97.79 U$15.3 | v57.94,118.75 57.31,118.11 R59.1 | v15.24,62.39 15.24,58.74 CHARGER.P$13 | 99.38,118.11 v103.82,113.67 | R47.1 99.38,118.11 | 99.38,118.11 v102.87,121.6 | v65.92,43.78 72.87,36.83 72.87,32.82 v73.18,32.5 | v73.66,28.89 83.19,19.37 v83.19,18.89 | JP10.7 80.33,9.53 84.3,9.53 v84.3,10.79 | R48.1 84.06,118.11 v84.5,117.67 | v94.69,114.3 94.93,114.05 94.93,113.19 | v86.99,115.66 v92.96,115.66 | R43.1 82.07,85.09 v84.3,82.87 | v118.59,87.63 117.18,86.23 116.68,86.23 116.2,85.75 v116.2,85.09 | R42.1 95.11,85.09 95.29,84.91 99.01,84.91 v99.73,84.18 | v89.65,94.73 88.31,94.73 87.63,95.41 | v84.57,86.32 84.57,87.97 v85.06,88.45 | v84.89,93.62 84.3,94.21 84.3,94.3 | U$11.3 83.81,64.89 81.16,67.54 72.94,67.54 v67.79,62.39 | U$13.3 62.98,64.89 v63.02,64.93 | V3.7 130.13,69.85 v130.49,69.49 | 130.49,69.37 130.57,69.45 | v77.31,115.57 77.95,114.94 78.42,114.94 | v69.69,116.2 68.74,116.2 68.58,116.36 | v59.53,122.16 59.93,121.76 60.17,121.76 | v31.61,89.71 35.24,93.34 v37.94,93.34 | v42.55,96.2 43.66,97.31 44.29,97.31 | U$18.3 52.9,93.98 v53.86,93.98 | U$14.3 50.76,66.67 v50.96,66.67 | v73.62,133.79 73.38,133.54 v66.2,133.54 | v133.67,105.73 133.11,105.18 133.11,104.59 132.49,103.96 | v130.79,103.96 132.49,103.96 | 132.49,103.96 129.12,100.6 127.95,100.6 123.95,96.6 120.02,96.6 v119.38,97.23
  Bottom 0.203: v135.1,51.12 132.96,48.98 132.93,48.98 132.27,48.32 v131.98,48.32 | v130.2,45.38 130.65,44.93 v130.65,38.42
  Bottom 0.61: V3.7 124.5,71.08 124.43,71.08 120.53,74.97 v117,74.97 | U$18.3 48.97,81.9 v49.37,81.5 | v52.23,82.71 53.18,82.71 53.66,82.23 | v56.83,95.57 57.63,96.36 57.94,96.36
  pour Bottom: 2.54,2.54 137.16,2.54 137.16,144.78 2.54,144.78
GND_PWM~5V  (via drill 0.61)
  Top 0.61: IC1.2 8.89,129.22 13.34,133.67 13.34,134.14 C5.2 13.65,134.14 18.73,134.14 | 18.73,134.14 22.86,138.27 23.18,138.27 U2.3 | 33.18,87.79 49.85,87.79 v51.91,89.85 | 33.18,87.79 30.96,87.79 30.16,87 24.61,87 C6.1 | 33.18,87.79 33.18,113.82 18.89,128.11 18.89,133.99 18.73,134.14 | 117.87,63.26 117.95,63.34 117.95,63.5 122.87,68.42 127,68.42 127.95,69.37 127.95,80.01 133.03,85.09 V3.14 | 117.87,63.26 V4.14 113.03,58.42 v113.03,45.72 | JP2.1 101.12,10.16 v101.12,11.59 103.82,14.29 v103.82,28.42 | v92.87,86.68 94.46,86.68 117.87,63.26
  Bottom 0.61: D13.3 51.91,88.58 v51.91,89.85 52.7,90.65 64.45,90.65 | 64.45,90.65 64.45,88.58 D12.3 | 76.52,90.65 76.52,88.58 D11.3 | 64.45,90.65 76.52,90.65 | 105.09,32.38 105.57,32.86 106.05,32.86 C36.2 | 105.09,32.38 105.09,29.37 106.05,29.37 C35.+ 104.93,29.21 104.14,28.42 v103.82,28.42 | 107.63,43.66 106.05,42.07 C37.+ 105.89,41.75 104.14,41.75 104.14,33.34 105.09,32.38 | 107.63,43.66 109.54,45.56 111.76,45.56 C38.2 111.92,45.72 v113.03,45.72 | C39.+ 116.84,42.07 115.41,43.5 107.79,43.5 107.63,43.66 | C41.+ 34.29,29.21 32.38,29.21 32.38,18.1 33.81,16.67 34.29,16.67 C40.2 34.45,16.51 37.47,13.49 102.71,13.49 102.87,13.34 | v101.12,11.59 102.87,13.34 | 102.87,13.34 106.05,16.51 C34.2 | v92.87,86.68 90.65,86.68 88.9,88.42 D10.3 88.58,88.58 88.58,89.85 87.79,90.65 76.52,90.65
GND_PWM~5V1(2)  (via drill 0.61)
  Top 0.61: 11.43,94.46 11.43,96.52 9.37,98.58 IC2.2 | 11.43,94.46 11.43,69.53 | 11.43,69.53 11.43,68.58 C51.2 | 11.43,69.53 15.08,69.53 v19.21,65.41 | v34.61,97 v52.39,114.78 | v11.59,94.46 11.43,94.46
  Bottom 0.61: 76.52,123.67 76.52,121.6 D15.3 | 76.52,123.67 71.28,123.67 69.22,121.6 D16.3 64.45,121.6 64.45,122.56 63.34,123.67 54.61,123.67 D17.3 52.39,121.44 v52.39,114.78 | 76.52,123.67 88.58,123.67 88.58,121.6 D14.3 | C46.2 23.5,17.78 20.95,20.32 20.95,29.21 23.5,29.21 C47.+ 23.65,29.53 24.45,29.53 24.45,32.38 24.13,32.7 | 24.13,32.7 23.97,32.86 23.5,32.86 C48.2 | 32.38,32.86 24.29,32.86 24.13,32.7 | 32.38,32.86 34.29,32.86 C42.2 | C43.+ 34.29,42.07 30.8,45.56 29.21,45.56 C44.2 29.05,45.56 26.99,45.56 | C45.+ 116.84,29.37 120.49,33.02 120.49,46.35 113.98,46.35 113.51,46.83 38.73,46.83 34.29,42.39 C43.+ | 26.99,45.56 23.5,42.07 C49.+ | 32.38,32.86 32.38,41.75 34.13,41.75 C43.+ | v19.21,65.41 19.21,52.23 26.04,52.23 26.83,51.44 26.83,45.72 26.99,45.56 | v34.61,97 32.07,94.46 v11.59,94.46
I2C_SCL  (via drill 0.61)
  Top 0.61: v74.77,143.19 78.11,143.19 U1.36 | JP10.10 v83.5,5.08
  Bottom 0.61: v74.77,143.19 73.82,144.15 37.47,144.15 1.91,108.58 1.91,7.94 37.47,7.94 40.32,5.08 v83.5,5.08
I2C_SDA  (via drill 0.61)
  Top 0.61: v72.07,140.49 73.18,139.38 78.11,139.38 U1.33 | v56.04,142.08 34.45,120.49 v34.45,98.74 | v34.13,83.98 34.13,47.62 37.94,43.81 v37.94,40.64 | v80.01,14.61 80.01,11.75 JP10.9
  Bottom 0.61: v72.07,140.49 70.48,142.08 v56.04,142.08 | v37.94,40.64 53.18,25.4 69.22,25.4 v80.01,14.61 | v34.45,98.74 39.05,94.14 39.05,88.9 v34.13,83.98
IO0
  Top 0.61: 115.89,98.11 116.05,98.27 116.36,98.27 C3.1 116.52,98.58 118.43,100.49 118.9,100.49 | 115.89,98.11 115.25,97.47 115.25,95.89 116.68,94.46 116.68,92.23 R44.2 | Q2.2 128.75,92.87 128.75,93.82 128.91,93.98 128.91,95.57 128.43,96.04 124.22,96.04 119.78,100.49 118.9,100.49 | 115.89,98.11 111.92,102.08 110.01,102.08 83.03,129.06 78.26,129.06 U1.25 | 118.9,100.49 118.9,106.68 126.36,114.14 134.14,114.14 S3.1
MISO  (via drill 0.61)
  Top 0.61: v72.71,126.36 72.71,128.11 U1.22 | v68.1,122.71 68.1,103.66 69.06,102.71 v69.06,102.39 | v66.83,101.92 66.83,95.25 65.72,94.14 65.72,84.14 74.61,75.25 v74.61,59.69 | v81.12,58.42 81.12,34.13 v77.31,30.32 | v77.31,26.67 77.31,11.59 JP10.5
  Bottom 0.61: v72.71,126.36 69.06,122.71 v68.1,122.71 | v69.06,102.39 68.58,101.92 v66.83,101.92 | v74.61,59.69 75.88,58.42 v81.12,58.42 | v77.31,26.67 v77.31,30.32
MOSI  (via drill 0.61)
  Top 0.61: v71.44,131.92 71.44,128.27 U1.21 | v43.81,88.9 v43.81,102.39 | v40.32,66.04 40.32,57.47 40.16,57.31 40.16,28.89 v45.72,23.34 | JP10.4 v64.45,14.61
  Bottom 0.61: v71.44,131.92 70.88,132.48 65.52,132.48 64.8,133.19 58.9,133.19 43.81,118.11 v43.81,102.39 | v43.81,88.9 43.81,80.64 40.32,77.15 v40.32,66.04 | v45.72,23.34 54.45,14.61 v64.45,14.61
N$3  (via drill 0.61)
  Top 0.203: U3.26 125.61,105.01 125.61,104.43 133.51,96.53 133.51,94.3 134.3,93.5 v134.3,91.6 | R51.1 123.05,88.49 v122.08,88.49 | v133.51,88.27 131.65,88.27 v131.17,88.74
  Bottom 0.203: v122.08,88.49 125.07,88.49 125.85,87.72 126.56,87.72 127.27,88.42 130.85,88.42 v131.17,88.74 | v133.51,88.27 134.3,89.06 v134.3,91.6
N$12
  Bottom 0.61: C35.- C34.1
N$13
  Bottom 0.61: C36.1 106.05,31.91 106.52,31.91 107,32.38 107,35.4 106.05,35.4 C37.-
N$14
  Top 0.61: R52.2 123.98,89.85 123.98,91.76 123.03,92.71 Q1.1
N$15
  Bottom 0.61: C38.1 111.76,44.45 118.27,44.45 118.75,43.97 118.75,35.56 116.84,35.56 C39.-
N$16
  Bottom 0.61: C41.- C40.1
N$17
  Bottom 0.61: C42.1 34.29,31.91 34.77,31.91 35.24,32.38 35.24,35.4 34.29,35.4 C43.-
N$18  (via drill 0.61)
  Top 0.61: v36.83,43.34 v31.43,43.34
  Bottom 0.61: v31.43,43.34 30.32,43.34 29.21,44.45 C44.1 | v36.83,43.34 48.74,31.43 99.22,31.43 104.14,26.51 113.19,26.51 116.84,22.86 C45.-
N$19
  Bottom 0.61: C46.1 23.5,16.67 23.97,16.67 24.45,17.14 24.45,22.7 23.5,22.7 C47.-
N$20
  Bottom 0.61: C48.1 23.5,31.91 23.02,31.91 22.54,32.38 22.54,35.4 23.5,35.4 C49.-
N$25
  Top 0.61: R53.2 127.64,89.69 127.64,91.92 126.84,92.71 Q2.1
N$26  (via drill 0.61)
  Top 0.61: R54.1 23.5,106.36 23.5,105.89 24.77,104.62 26.83,104.62 32.07,99.38 Q3.1 32.23,99.22 32.23,96.36 31.59,95.73 31.59,94.46 C2.2 31.75,94.3 v31.75,92.55 | v18.89,82.07 v18.89,67.31
  Bottom 0.61: v18.89,67.31 12.86,67.31 12.86,58.74 CHARGER.P$14 | v18.89,82.07 21.75,84.93 24.13,84.93 v31.75,92.55
N$28  (via drill 0.61)
  Top 0.61: 89.38,79.53 89.38,67.31 v88.42,66.36 | 89.38,79.53 v89.38,83.82 | v99.54,80.01 96.68,80.01 96.2,79.53 89.38,79.53
  Bottom 0.61: v89.38,83.82 89.53,83.82 R42.2 | v88.42,66.36 89.85,64.93 90.17,64.93 U$11.1 | v99.54,80.01 V3.3
N$30
  Top 0.61: D1.1 31.27,90.96 28.73,93.5 28.73,95.25 30.64,97.16 30.96,97.16 Q3.3
N$31
  Top 0.61: C16.2 21.91,67.15 22.38,67.63 22.38,67.79 22.86,68.26 24.29,68.26 24.77,67.79 24.77,63.5 20.48,59.21 20.48,58.74 CHARGER.P$11
N$32
  Top 0.61: R56.1 6.83,68.26 6.83,67.63 6.03,66.83 6.03,60.33 7.62,58.74 CHARGER.P$16 7.78,58.42 7.78,51.12 CHARGER.P$1
N$33  (via drill 0.61)
  Top 0.61: v80.01,81.6 80.01,70.17 v80.01,66.67
  Bottom 0.61: 80.01,81.76 96.2,81.76 101.28,76.68 121.28,76.68 125.57,72.39 V3.6 | 80.01,81.76 78.9,81.76 78.9,85.09 R43.2 | v80.01,66.67 78.26,64.93 U$12.1 | v80.01,81.6 80.01,81.76
N$34  (via drill 0.61)
  Top 0.61: v66.67,67.63 v66.67,81.6
  Bottom 0.61: v66.67,81.6 R45.2 | U$13.1 66.2,64.93 66.67,64.93 v66.67,67.63 67.47,68.42 131.92,68.42 V3.8
N$36  (via drill 0.61)
  Top 0.61: v55.88,66.67 54.77,67.79 v54.77,81.6 57.94,84.77 v57.94,92.71 | V3.11 134.46,78.58 134.62,78.58 135.57,79.53 135.57,85.57 134.46,86.68 121.36,86.68 v119.77,88.27
  Bottom 0.61: v54.77,81.6 54.77,85.09 R46.2 | v55.88,66.67 54.13,64.93 U$14.1 | v57.94,92.71 58.1,92.55 115.48,92.55 v119.77,88.27
N$37  (via drill 0.61)
  Top 0.61: v110.01,66.36 110.01,69.53 v101.76,77.79 | v103.82,78.9 103.5,78.9 88.58,93.82 88.58,99.38 v87.31,100.65 87.48,100.81 87.48,107 88.9,108.42 88.9,115.26 87.48,116.68 v87.48,117.39
  Bottom 0.61: v87.31,100.65 90.01,97.95 90.17,97.95 U$15.1 | V4.3 121.92,60.01 116.36,60.01 v110.01,66.36 | v101.76,77.79 102.87,78.9 v103.82,78.9 | v87.48,117.39 88.2,118.11 R47.2
N$38  (via drill 0.61)
  Top 0.61: v78.74,116.52 78.74,104.78 79.85,103.66 v79.85,100.33 80.01,100.17 80.01,98.9 83.82,95.09 83.82,88.18 84.61,87.39 85.02,87.39 85.65,86.76 90.88,86.76 95.73,81.92 v95.73,80.64 | v119.38,50.48 113.51,44.61 112.55,44.61 108.58,48.58 108.58,67.79 v97.47,78.9
  Bottom 0.61: v78.74,116.52 R48.2 | v79.85,100.33 79.85,97.95 78.26,97.95 U$16.1 | V4.6 129.54,52.55 127.64,52.55 127.56,52.47 125.57,50.48 v119.38,50.48 | v95.73,80.64 v97.47,78.9
N$39  (via drill 0.61)
  Top 0.61: v66.83,114.62 66.83,103.66 67.94,102.55 v67.94,99.69 68.1,99.54 68.1,93.82 78.9,83.03 v78.9,70.96 | V4.8 132.08,62.55 v127.32,67.31 | v105.25,69.53 v107.47,67.31
  Bottom 0.61: v66.83,114.62 66.83,118.11 R49.2 | v67.94,99.69 66.2,97.95 U$17.1 | v127.32,67.31 127.16,67.47 107.63,67.47 v107.47,67.31 | v105.25,69.53 105.09,69.37 90.09,69.37 89.14,70.33 79.53,70.33 v78.9,70.96
N$40  (via drill 0.61)
  Top 0.61: v57.94,100.01 v57.94,114.62 | v124.46,65.56 V4.11 | v116.36,66.36 116.05,66.36 104.93,77.47 v104.93,86.68
  Bottom 0.61: v57.94,114.62 54.77,114.62 54.77,118.11 R59.2 | v57.94,100.01 55.88,97.95 55.56,97.95 | 55.56,97.95 54.13,97.95 U$18.1 | v124.46,65.56 123.51,66.52 116.52,66.52 v116.36,66.36 | v104.93,86.68 100.01,91.6 56.52,91.6 55.56,92.55 55.56,97.95
PORT_9~5V  (via drill 0.61)
  Top 0.61: v94.14,80.64 93.42,81.36 91.04,81.36 90.44,81.96 90.44,84.34 v89.38,85.41 | JP2.4 106.52,37.78 107.63,38.89 107.63,65.56 v102.71,70.48
  Bottom 0.61: v89.38,85.41 88.9,85.41 86.68,87.63 D10.1 | v94.14,80.64 89.85,76.36 87.79,76.36 U$11.2 92.87,79.06 101.44,70.48 v102.71,70.48
PORT_10~5V  (via drill 0.61)
  Top 0.61: v109.06,36.83 JP2.5 | v106.52,39.37 106.52,54.45 v90.49,70.48
  Bottom 0.61: D11.1 74.61,87.63 74.61,76.36 75.56,76.36 U$12.2 75.88,76.2 80.8,71.28 89.69,71.28 v90.49,70.48 | v106.52,39.37 v109.06,36.83
PORT_11~5V  (via drill 0.61)
  Top 0.61: v54.77,57.94 55.88,56.83 55.88,55.56 46.83,46.51 46.83,7.94 JP11.3
  Bottom 0.61: D12.1 62.55,87.63 62.55,76.36 63.5,76.36 U$13.2 63.66,76.04 64.14,76.04 64.14,64.29 62.23,62.39 54.77,62.39 v54.77,57.94
PORT_12~5V  (via drill 0.61)
  Top 0.61: v45.09,68.9 45.4,68.9 47.78,66.52 56.83,57.47 56.83,56.67 59.37,54.13 59.37,7.94 JP11.8
  Bottom 0.61: D13.1 50.48,87.63 50.48,76.36 51.44,76.36 U$14.2 50.32,76.2 50.32,74.14 v45.09,68.9
PORT_13~5V  (via drill 0.61)
  Top 0.61: v40.8,6.19 27.15,19.84 v27.15,76.83 | v44.93,90.49 44.93,93.03 v53.82,101.92 | v86.04,114.62 v86.04,103.5
  Bottom 0.61: 85.57,114.62 85.57,109.38 87.63,109.38 U$15.2 | 85.57,114.62 85.57,119.7 D14.1 | v40.8,6.19 55.09,6.19 56.83,7.94 JP11.7 | v27.15,76.83 25.08,78.9 25.08,81.92 35.24,81.92 43.81,90.49 v44.93,90.49 | v53.82,101.92 55.56,103.66 85.88,103.66 v86.04,103.5 | 85.57,114.62 v86.04,114.62
PWM1(5V)  (via drill 0.61)
  Top 0.61: v82.39,132.24 82.39,132.4 79.38,135.41 78.26,135.41 U1.30
  Bottom 0.61: v82.39,132.24 91.28,123.35 124.46,123.35 138.27,109.54 138.27,56.83 129.06,56.83 127,54.77 V4.5
PWM2(5V)  (via drill 0.61)
  Top 0.61: v99.54,116.68 79.53,136.68 78.26,136.68 U1.31 | v99.54,107.79 99.54,86.2 102.39,83.34 103.35,83.34 103.98,83.98 103.98,86.04 103.82,86.2 103.82,87.15 104.46,87.79 105.41,87.79 106.05,87.15 106.05,77.63 116.2,67.47 116.84,67.47 118.27,66.04 v118.27,65.41
  Bottom 0.61: v99.54,107.79 v99.54,116.68 | v118.27,65.41 119.22,64.45 124.94,64.45 127,62.39 V4.10
PWM3(5V)  (via drill 0.61)
  Top 0.61: v96.2,133.67 91.44,133.67 80.8,144.3 78.26,144.3 U1.37 | v103.82,126.36 104.14,126.36 v120.49,110.01 | v132.24,93.5 v120.49,105.25 | v130.81,81.28 128.91,79.38 128.91,68.1 133.51,63.5 133.51,60.96 132.56,60.01 121.44,60.01 119.38,62.07 V4.13
  Bottom 0.61: v96.2,133.67 103.5,126.36 v103.82,126.36 | v120.49,105.25 v120.49,110.01 | v132.24,93.5 132.24,92.23 131.6,91.6 131.6,89.82 132.24,89.18 132.24,86.52 132.08,86.52 130.81,85.25 v130.81,81.28
PWM_1~5V  (via drill 0.61)
  Top 0.61: v58.26,16.83 49.37,7.94 JP11.4 | v64.77,23.34 64.77,39.85 80.01,55.09 v80.01,59.85 | v76.99,83.34 v76.99,61.12 | v76.99,87.31 76.99,94.14 74.77,96.36 v74.77,114.62
  Bottom 0.61: 74.61,114.62 74.61,109.38 75.56,109.38 U$16.2 | 74.61,114.62 74.61,120.65 D15.1 | v64.77,23.34 v58.26,16.83 | v80.01,59.85 78.74,61.12 v76.99,61.12 | v76.99,87.31 v76.99,83.34 | v74.77,114.62 74.61,114.62
PWM_2~5V  (via drill 0.61)
  Top 0.61: JP11.5 52.23,7.94 53.82,6.35 60.01,6.35 61.91,8.26 61.91,38.26 78.74,55.09 v78.74,59.53 | v75.88,60.01 75.88,84.61 v66.83,93.66 | v61.75,114.62 v61.75,93.98
  Bottom 0.61: D16.1 62.55,120.65 63.66,119.54 69.53,119.54 71.44,117.63 71.44,115.89 68.58,113.03 67.31,113.03 63.66,109.38 U$17.2 65.25,111.28 65.09,111.28 v61.75,114.62 | v78.74,59.53 78.26,60.01 v75.88,60.01 | v66.83,93.66 66.52,93.98 v61.75,93.98
PWM_3~5V  (via drill 0.61)
  Top 0.61: v45.72,12.38 45.72,20.16 30.32,35.56 v30.32,85.88 | v35.56,91.12 35.56,95.73 v44.93,105.09
  Bottom 0.61: D17.1 50.48,120.65 50.48,109.38 51.44,109.38 U$18.2 50.32,109.22 49.05,109.22 v44.93,105.09 | v45.72,12.38 49.85,12.38 54.29,7.94 JP11.6 | v35.56,91.12 v30.32,85.88
RTS  (via drill 0.61)
  Top 0.203: Q1.2 126.68,90.96 126.68,89.69 R53.1 126.95,89.5 126.95,89.35 127.33,88.97 129.45,88.97 129.86,89.38 129.9,89.38 130.13,89.61 131.53,89.61 131.56,89.58 v133.31,89.58 | U3.24 124.58,105.01 124.58,102.2 127.04,99.73 v128.31,99.73
  Bottom 0.203: v133.31,89.58 133.31,94.64 128.31,99.64 v128.31,99.73
RX0  (via drill 0.51, 0.61)
  Top 0.203: v128.75,123.35 v128.75,115.25 | v76.36,140.81 77.95,140.81 78.11,140.65 U1.34 | v3.02,123.19 1.43,121.6 1.43,44.29 40.48,5.24 41.12,5.24 41.75,5.87 41.75,7.94 JP11.1 | v126.3,101.75 125.09,102.95 U3.25
  Bottom 0.203: v128.75,115.25 129.06,115.25 129.06,106.79 129.02,106.75 129.02,102.82 127.94,101.75 v126.3,101.75 | v128.75,123.35 128.75,140.81 78.42,140.81 | v76.36,140.81 78.42,140.81 | v3.02,123.19 24.77,144.94 74.3,144.94 78.42,140.81
SCK  (via drill 0.61)
  Top 0.61: v72.71,122.56 70.33,124.94 70.33,128.11 U1.20 | v72.71,115.73 72.71,115.41 70.17,112.87 v70.17,98.27 | v56.67,93.03 56.67,90.96 v41.43,75.72 | v39.05,64.93 39.05,28.42 v43.02,24.45 | v78.42,14.61 78.42,10.16 JP10.6
  Bottom 0.61: v72.71,115.73 v72.71,122.56 | v70.17,98.27 66.99,95.09 58.74,95.09 v56.67,93.03 | v41.43,75.72 41.43,64.93 v39.05,64.93 | v43.02,24.45 68.58,24.45 v78.42,14.61
SCREEN_RX
  Top 0.61: JP4.2 102.23,111.12 83.34,130.02 81.76,130.02 80.17,131.6 78.26,131.6 U1.27
SCREEN_TX
  Top 0.61: JP4.3 112.39,111.6 111.76,112.24 102.39,112.24 83.66,130.97 82.07,130.97 80.17,132.87 78.26,132.87 U1.28
SS  (via drill 0.61)
  Top 0.61: v85.09,102.55 85.09,100.17 84.45,99.54 83.5,99.54 82.87,100.17 82.87,116.52 75.41,123.98 75.41,128.11 U1.24 | v77.63,95.09 v77.63,102.55 | v79.85,89.53 v79.85,93.66 | v87,84.14 87.79,83.34 87.79,67.31 87.31,66.83 v87.31,61.75 | v87.31,56.04 87.31,38.73 77.79,29.21 75.72,29.21 63.34,16.83 63.34,13.18 JP10.3
  Bottom 0.61: v77.63,102.55 v85.09,102.55 | v77.63,95.09 79.06,93.66 v79.85,93.66 | v79.85,89.53 85.25,84.14 v87,84.14 | v87.31,56.04 v87.31,61.75
TEMP
  Top 0.61: R56.2 7.94,68.26 7.94,67.47 7.14,66.67 7.14,65.56 R57.2 7.14,65.41 7.14,64.77 11.59,60.33 11.59,58.1 17.46,52.23 18.41,52.23 19.21,51.44 19.21,49.05 19.84,48.42 20.95,48.42 22.86,50.32 22.86,50.96 CHARGER.P$7
TX0  (via drill 0.61)
  Top 0.61: R51.2 126.05,88.42 v126.21,88.58 | v114.62,111.76 114.62,114.46 110.49,118.59 100.49,118.59 79.85,139.22 79.85,141.29 79.38,141.76 78.26,141.76 U1.35 | JP11.2 44.61,7.94 48.58,3.97 84.45,3.97 88.42,7.94 v88.42,57.47 | v97.31,66.36 97.31,66.67 v102.71,72.07 | v109.7,75.56 109.7,77.79 107,80.49 107,94.14 v104.78,96.36
  Bottom 0.61: v126.21,88.58 130.18,92.55 130.49,92.55 131.13,93.19 131.13,95.89 118.75,95.89 117.32,97.31 111.6,97.31 108.74,100.17 | 108.74,100.17 105.41,103.5 105.41,105.09 107.95,105.09 v114.62,111.76 | v97.31,66.36 v88.42,57.47 | v102.71,72.07 106.2,75.56 v109.7,75.56 | v104.78,96.36 108.43,100.01 108.58,100.01 108.74,100.17
USB_DN
  Top 0.203: U3.5 127.5,107.9 129.59,107.9 131,106.49 131,104.97 132.13,103.84 J3.2
USB_DP  (via drill 0.61)
  Top 0.203: U3.4 128.81,107.41 129.83,106.39 v129.88,106.39 | J3.3 132.7,104.49 v132.25,104.94
  Bottom 0.203: v129.88,106.39 130.86,105.41 131.78,105.41 v132.25,104.94
V+  (via drill 0.61)
  Top 0.61: R55.1 95.09,128.43 92.23,131.29 92.23,131.44 91.28,132.4 C11.1 90.96,132.4 v84.77,138.59
  Bottom 0.61: 11.43,57.47 10.32,58.58 CHARGER.P$15 | 11.43,57.47 17.78,51.12 CHARGER.P$5 | v84.77,138.59 84.61,138.75 72.23,138.75 70.01,140.97 36.83,140.97 3.81,107.95 3.81,57.31 11.27,57.31 11.43,57.47
VDD33  (via drill 0.51)
  Top 0.203: V3.1 124.14,83.5 121.13,83.5 116.84,87.79 116.84,90.96 R44.1 | U3.7 127.48,108.43 U3.6 127.64,108.43 130.33,108.43 v131.6,107.16 | Q4.1 130.02,41.12 130.02,43.97 Q5.VCC 132.79,47.87 132.79,48.66 132.31,49.14 132.16,49.14 128.59,52.7 126.36,52.7 V4.4 | C7.1 24.61,91.44 24.61,94.3 R1.2 24.61,94.46 25.4,94.46 v26.51,95.57 | C8.1 24.92,97.47 v24.92,98.58 24.92,100.33 C9.1 24.77,100.49 23.65,101.6 22.23,101.6 v19.53,104.3 | v104.78,132.24 100.33,132.24 C12.2 100.17,132.24 100.17,132.56 86.2,146.53 60.01,146.53 57.78,144.3 | v106.68,133.51 106.68,132.24 C13.2 106.68,132.08 108.74,132.08 v120.02,120.81 | 24.13,140.97 27.46,144.3 57.78,144.3 | 24.13,140.97 21.59,138.43 20.95,138.43 U2.2 | 57.78,144.3 61.12,144.3 U1.2 | 24.13,140.97 v24.13,125.41
  Bottom 0.203: 127.79,75.41 130.81,72.39 V3.9 135.25,70.48 135.25,64.14 131.44,64.14 V4.9 127,59.69 124.46,59.69 | 127.79,75.41 V3.4 | V3.1 130.81,80.01 132.4,80.01 | 132.4,80.01 127.79,75.41 | 132.4,80.01 V3.12 136.53,80.01 136.53,107.39 134.54,109.38 | 124.46,59.69 V4.12 | 124.46,59.69 V4.4 122.56,52.7 118.75,52.7 V4.1 116.36,55.09 87,55.09 84.61,57.47 70.96,57.47 69.69,56.2 JP8.4 | v26.51,95.57 26.51,98.58 v24.92,98.58 | v104.78,132.24 106.05,133.51 v106.68,133.51 | v19.53,104.3 19.53,121.44 23.5,125.41 v24.13,125.41 | v120.02,120.81 124.46,120.81 134.54,110.73 134.54,109.38 | v131.6,107.16 133.19,107.16 134.54,108.51 134.54,109.38
VIN  (via drill 0.61)
  Top 0.61: 20.32,85.25 13.65,78.58 13.65,77.95 S2.2 | 20.32,85.25 22.7,87.63 | 22.7,87.63 23.02,87.95 23.81,87.95 24.45,88.58 24.45,89.22 C4.2 | 22.7,87.63 10.16,100.17 6.19,100.17 2.22,104.14 2.22,120.81 4.13,122.71 4.13,129.06 IC1.1 | 20.32,85.25 v26.19,79.38 | JP8.8 59.37,56.2 v36.35,79.22
  Bottom 0.61: v36.35,79.22 36.2,79.38 v26.19,79.38
VIN1
  Top 0.61: C10.2 11.43,66.04 11.43,67.15 2.86,75.72 2.86,96.84 4.6,98.58 IC2.1
VN_SENSOR  (via drill 0.61)
  Top 0.61: v35.24,52.07 35.24,79.69 35.88,80.33 43.97,80.33 52.98,89.33 52.98,90.29 52.79,90.48 52.79,96.77 54.93,98.9 54.93,102.39 53.5,103.82 53.5,135.1 58.9,140.49 61.12,140.49 U1.5 | v118.43,47.47 118.43,26.35 S5.P
  Bottom 0.61: v35.24,52.07 39.53,47.78 118.11,47.78 v118.43,47.47
VN_SENSOR_IN
  Bottom 0.61: S5.O 120.97,10.48 88.42,10.48 86.84,12.06 81.44,12.06 79.85,10.48 68.58,10.48 JP10.2
VN_SENSOR_LDR
  Top 0.61: Q4.2 132.08,38.1 132.56,37.62 132.56,35.72 131.76,34.92 131.13,34.92 R6.1 131.92,34.77 132.87,33.81 132.87,26.04 131.44,24.61 S5.S
VP_SENSOR  (via drill 0.61)
  Top 0.61: v35.56,99.54 35.4,99.69 35.4,120.17 52.86,137.64 53.18,137.64 57.31,141.76 61.12,141.76 U1.4 | v37.62,81.44 v37.62,85.88
  Bottom 0.61: v35.56,99.54 35.56,99.22 40.01,94.77 40.01,88.27 v37.62,85.88 | v37.62,81.44 37.62,54.29 113.82,54.29 127.48,40.64 127.48,27.62 127.95,27.62 S4.P
VP_SENSOR_IN
  Bottom 0.61: S4.O 132.87,20.16 132.87,9.53 90.01,9.53 86.84,6.35 65.09,6.35 JP10.1
VP_SENSOR_IR
  Bottom 0.61: S4.S 129.7,28.42 128.43,28.42 128.43,47.34 Q5.OUT

## Text on the board
tNames: NX4832T035 | Breadbord